# EAGLE schematic xen_teensy_motherboard_8cv_mki (EAGLE 9.6.0)
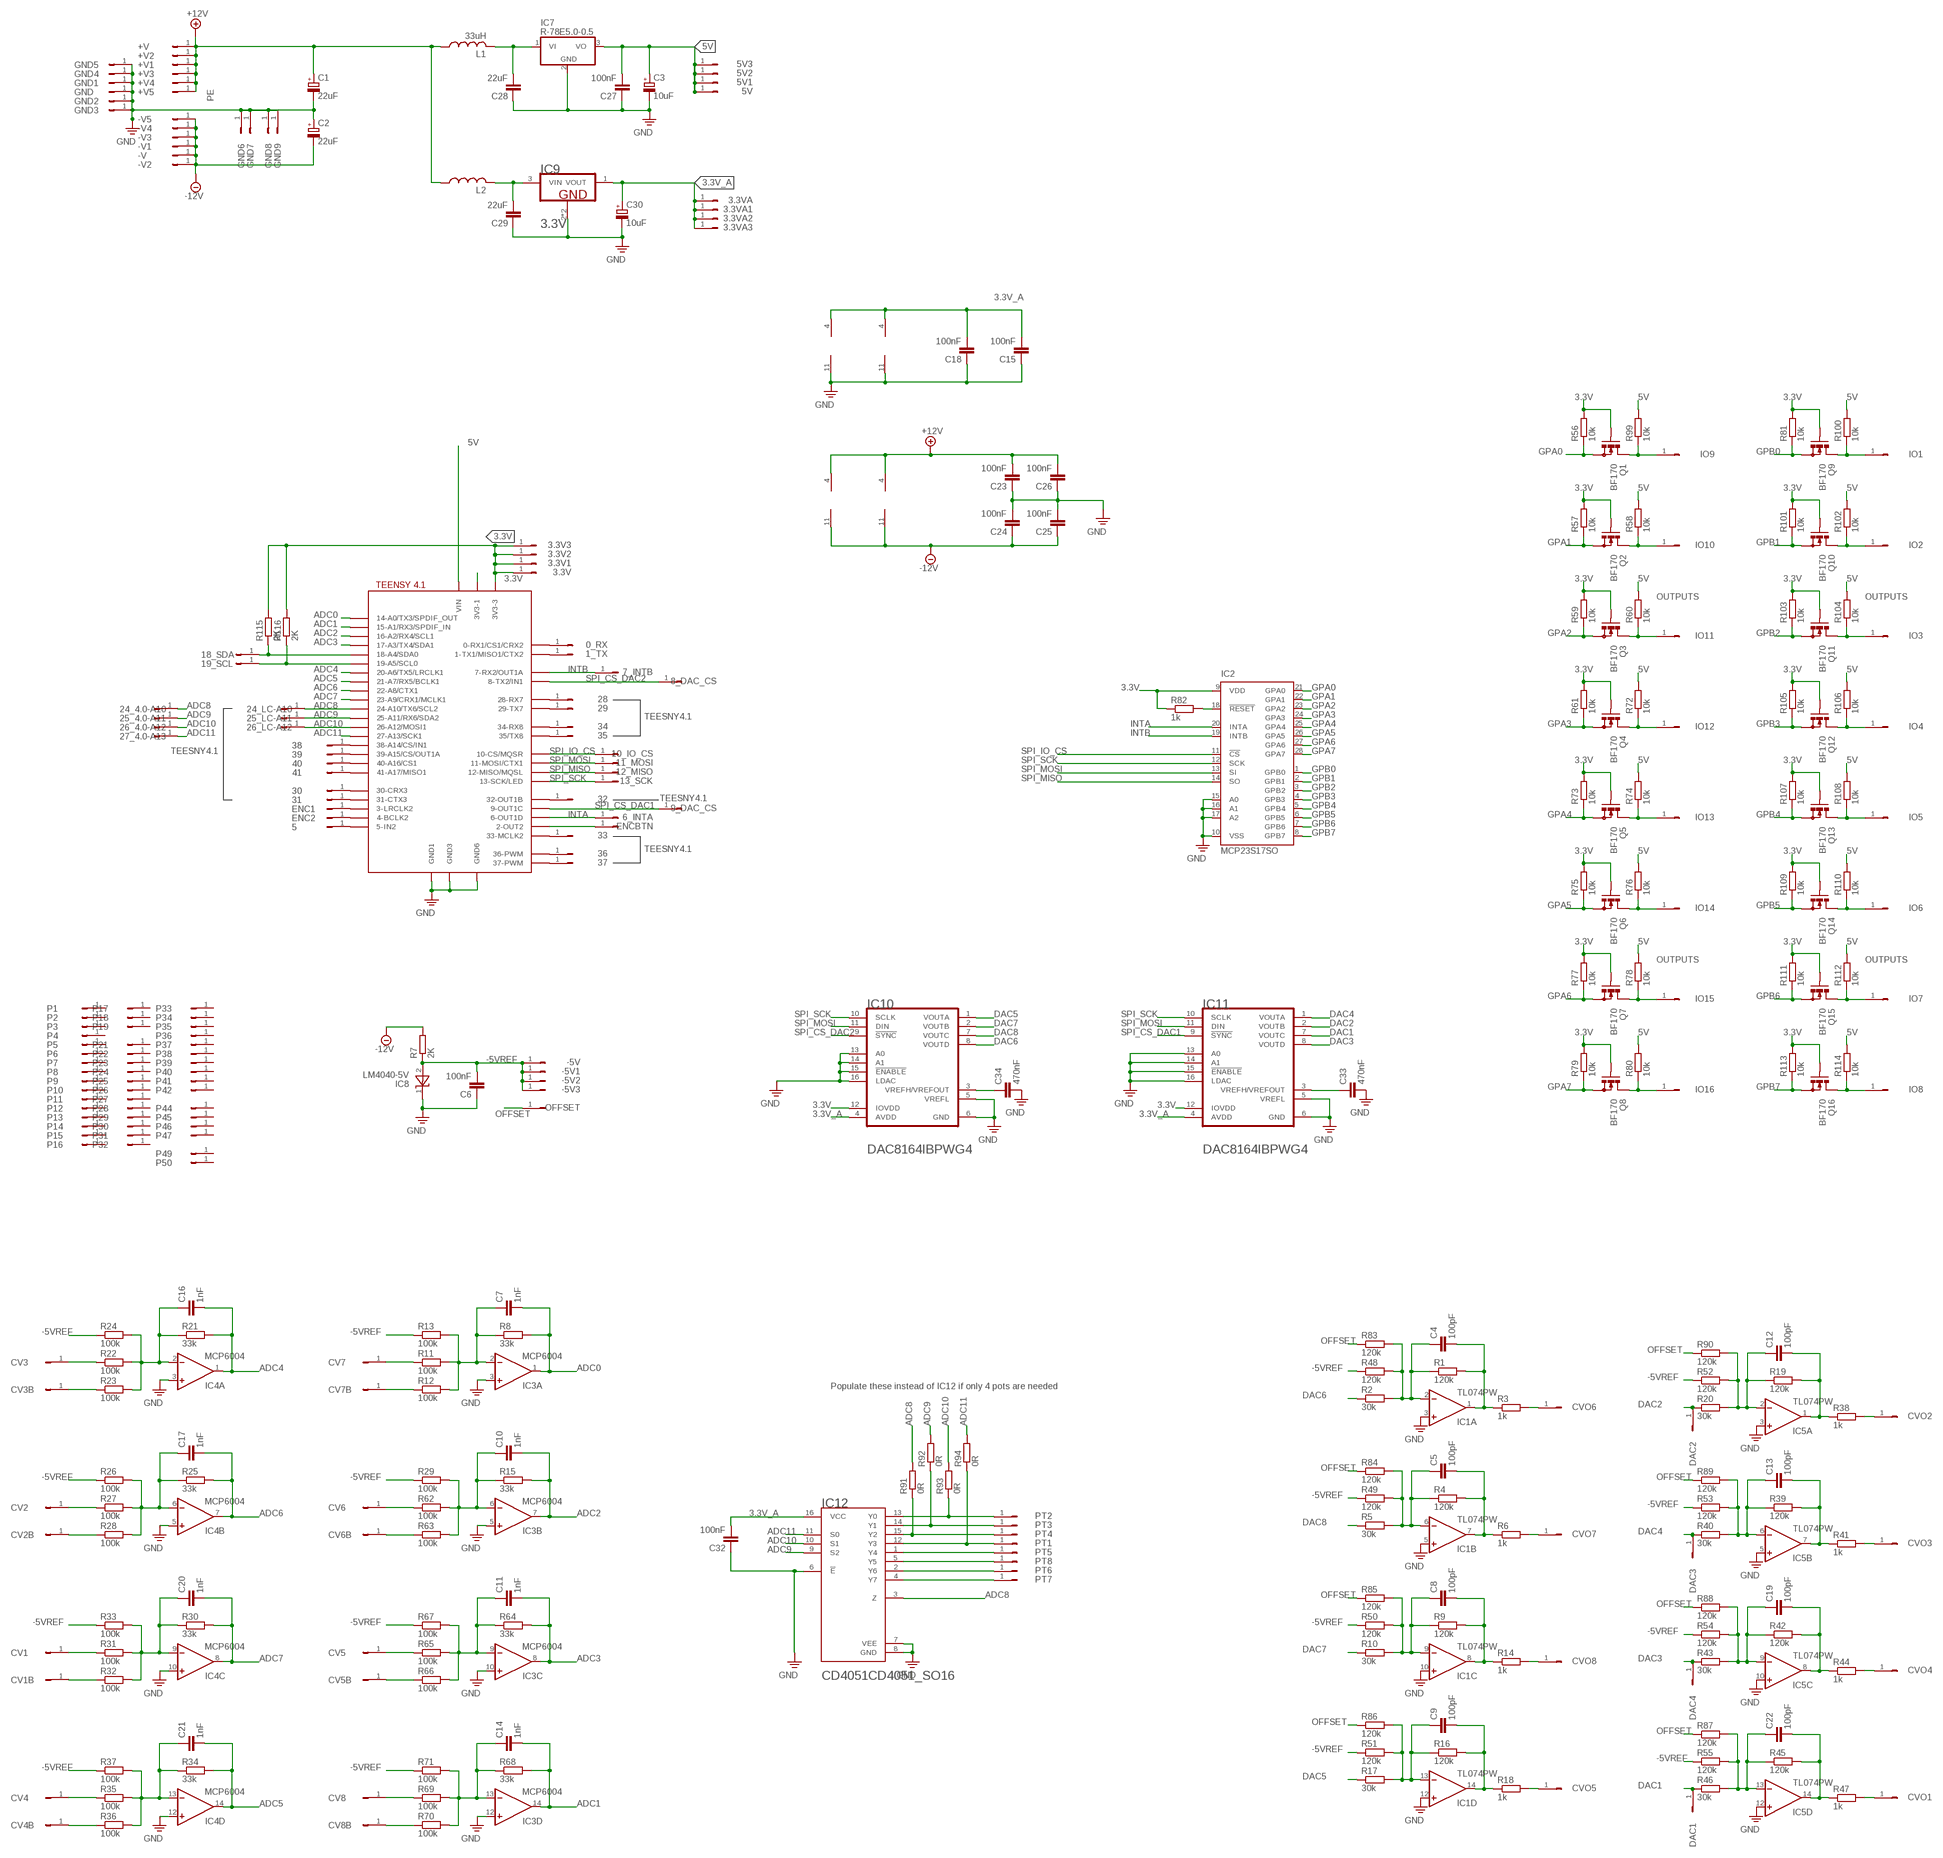
[diagram p0: schematic, sheet 1]

## Parts
0_RX  HEADER/MALE/01  [HEADER/MALE/01]
1_TX  HEADER/MALE/01  [HEADER/MALE/01]
3.3V  HEADER/MALE/01  [HEADER/MALE/01]
3.3V1  HEADER/MALE/01  [HEADER/MALE/01]
3.3V2  HEADER/MALE/01  [HEADER/MALE/01]
3.3V3  HEADER/MALE/01  [HEADER/MALE/01]
3.3VA  HEADER/MALE/01  [HEADER/MALE/01]
3.3VA1  HEADER/MALE/01  [HEADER/MALE/01]
3.3VA2  HEADER/MALE/01  [HEADER/MALE/01]
3.3VA3  HEADER/MALE/01  [HEADER/MALE/01]
5  HEADER/MALE/01  [HEADER/MALE/01]
5V  HEADER/MALE/01  [HEADER/MALE/01]
5V1  HEADER/MALE/01  [HEADER/MALE/01]
5V2  HEADER/MALE/01  [HEADER/MALE/01]
5V3  HEADER/MALE/01  [HEADER/MALE/01]
6_INTA  HEADER/MALE/01  [HEADER/MALE/01]
7_INTB  HEADER/MALE/01  [HEADER/MALE/01]
8_DAC_CS  HEADER/MALE/01  [HEADER/MALE/01]
9_DAC_CS  HEADER/MALE/01  [HEADER/MALE/01]
10_IO_CS  HEADER/MALE/01  [HEADER/MALE/01]
11_MOSI  HEADER/MALE/01  [HEADER/MALE/01]
12_MISO  HEADER/MALE/01  [HEADER/MALE/01]
13_SCK  HEADER/MALE/01  [HEADER/MALE/01]
18_SDA  HEADER/MALE/01  [HEADER/MALE/01]
19_SCL  HEADER/MALE/01  [HEADER/MALE/01]
24_4.0-A10  HEADER/MALE/01  [HEADER/MALE/01]
24_LC-A10  HEADER/MALE/01  [HEADER/MALE/01]
25_4.0-A11  HEADER/MALE/01  [HEADER/MALE/01]
25_LC-A11  HEADER/MALE/01  [HEADER/MALE/01]
26_4.0-A12  HEADER/MALE/01  [HEADER/MALE/01]
26_LC-A12  HEADER/MALE/01  [HEADER/MALE/01]
27_4.0-A13  HEADER/MALE/01  [HEADER/MALE/01]
28  HEADER/MALE/01  [HEADER/MALE/01]
29  HEADER/MALE/01  [HEADER/MALE/01]
30  HEADER/MALE/01  [HEADER/MALE/01]
31  HEADER/MALE/01  [HEADER/MALE/01]
32  HEADER/MALE/01  [HEADER/MALE/01]
33  HEADER/MALE/01  [HEADER/MALE/01]
34  HEADER/MALE/01  [HEADER/MALE/01]
35  HEADER/MALE/01  [HEADER/MALE/01]
36  HEADER/MALE/01  [HEADER/MALE/01]
37  HEADER/MALE/01  [HEADER/MALE/01]
38  HEADER/MALE/01  [HEADER/MALE/01]
39  HEADER/MALE/01  [HEADER/MALE/01]
40  HEADER/MALE/01  [HEADER/MALE/01]
41  HEADER/MALE/01  [HEADER/MALE/01]
+V  HEADER/MALE/01  [HEADER/MALE/01]
+V1  HEADER/MALE/01  [HEADER/MALE/01]
+V2  HEADER/MALE/01  [HEADER/MALE/01]
+V3  HEADER/MALE/01  [HEADER/MALE/01]
+V4  HEADER/MALE/01  [HEADER/MALE/01]
+V5  HEADER/MALE/01  [HEADER/MALE/01]
-5V  HEADER/MALE/01  [HEADER/MALE/01]
-5V1  HEADER/MALE/01  [HEADER/MALE/01]
-5V2  HEADER/MALE/01  [HEADER/MALE/01]
-5V3  HEADER/MALE/01  [HEADER/MALE/01]
-V  HEADER/MALE/01  [HEADER/MALE/01]
-V1  HEADER/MALE/01  [HEADER/MALE/01]
-V2  HEADER/MALE/01  [HEADER/MALE/01]
-V3  HEADER/MALE/01  [HEADER/MALE/01]
-V4  HEADER/MALE/01  [HEADER/MALE/01]
-V5  HEADER/MALE/01  [HEADER/MALE/01]
C1  22uF  CAPACITOR/POLARIZEDSMDC  [SV-C]
C2  22uF  CAPACITOR/POLARIZEDSMDC  [SV-C]
C3  10uF  CAPACITOR/POLARIZEDSMDB  [SV-B]
C4  100pF  CAPACITORC0603  [C0603]
C5  100pF  CAPACITORC0603  [C0603]
C6  100nF  CAPACITORC0603  [C0603]
C7  1nF  CAPACITORC0603  [C0603]
C8  100pF  CAPACITORC0603  [C0603]
C9  100pF  CAPACITORC0603  [C0603]
C10  1nF  CAPACITORC0603  [C0603]
C11  1nF  CAPACITORC0603  [C0603]
C12  100pF  CAPACITORC0603  [C0603]
C13  100pF  CAPACITORC0603  [C0603]
C14  1nF  CAPACITORC0603  [C0603]
C15  100nF  CAPACITORC0603  [C0603]
C16  1nF  CAPACITORC0603  [C0603]
C17  1nF  CAPACITORC0603  [C0603]
C18  100nF  CAPACITORC0603  [C0603]
C19  100pF  CAPACITORC0603  [C0603]
C20  1nF  CAPACITORC0603  [C0603]
C21  1nF  CAPACITORC0603  [C0603]
C22  100pF  CAPACITORC0603  [C0603]
C23  100nF  CAPACITORC0603  [C0603]
C24  100nF  CAPACITORC0603  [C0603]
C25  100nF  CAPACITORC0603  [C0603]
C26  100nF  CAPACITORC0603  [C0603]
C27  100nF  CAPACITORC0603  [C0603]
C28  22uF  CAPACITORC0805  [C0805]
C29  22uF  CAPACITORC0805  [C0805]
C30  10uF  CAPACITOR/POLARIZEDSMDB  [SV-B]
C32  100nF  CAPACITORC0603  [C0603]
C33  470nF  CAPACITORC0603  [C0603]
C34  470nF  CAPACITORC0603  [C0603]
CV1  HEADER/MALE/01  [HEADER/MALE/01]
CV1B  HEADER/MALE/01  [HEADER/MALE/01]
CV2  HEADER/MALE/01  [HEADER/MALE/01]
CV2B  HEADER/MALE/01  [HEADER/MALE/01]
CV3  HEADER/MALE/01  [HEADER/MALE/01]
CV3B  HEADER/MALE/01  [HEADER/MALE/01]
CV4  HEADER/MALE/01  [HEADER/MALE/01]
CV4B  HEADER/MALE/01  [HEADER/MALE/01]
CV5  HEADER/MALE/01  [HEADER/MALE/01]
CV5B  HEADER/MALE/01  [HEADER/MALE/01]
CV6  HEADER/MALE/01  [HEADER/MALE/01]
CV6B  HEADER/MALE/01  [HEADER/MALE/01]
CV7  HEADER/MALE/01  [HEADER/MALE/01]
CV7B  HEADER/MALE/01  [HEADER/MALE/01]
CV8  HEADER/MALE/01  [HEADER/MALE/01]
CV8B  HEADER/MALE/01  [HEADER/MALE/01]
CVO1  HEADER/MALE/01  [HEADER/MALE/01]
CVO2  HEADER/MALE/01  [HEADER/MALE/01]
CVO3  HEADER/MALE/01  [HEADER/MALE/01]
CVO4  HEADER/MALE/01  [HEADER/MALE/01]
CVO5  HEADER/MALE/01  [HEADER/MALE/01]
CVO6  HEADER/MALE/01  [HEADER/MALE/01]
CVO7  HEADER/MALE/01  [HEADER/MALE/01]
CVO8  HEADER/MALE/01  [HEADER/MALE/01]
DAC1  HEADER/MALE/01  [HEADER/MALE/01]
DAC2  HEADER/MALE/01  [HEADER/MALE/01]
DAC3  HEADER/MALE/01  [HEADER/MALE/01]
DAC4  HEADER/MALE/01  [HEADER/MALE/01]
ENC1  HEADER/MALE/01  [HEADER/MALE/01]
ENC2  HEADER/MALE/01  [HEADER/MALE/01]
ENCBTN  HEADER/MALE/01  [HEADER/MALE/01]
GND  HEADER/MALE/01  [HEADER/MALE/01]
GND1  HEADER/MALE/01  [HEADER/MALE/01]
GND2  HEADER/MALE/01  [HEADER/MALE/01]
GND3  HEADER/MALE/01  [HEADER/MALE/01]
GND4  HEADER/MALE/01  [HEADER/MALE/01]
GND5  HEADER/MALE/01  [HEADER/MALE/01]
GND6  HEADER/MALE/01  [HEADER/MALE/01]
GND7  HEADER/MALE/01  [HEADER/MALE/01]
GND8  HEADER/MALE/01  [HEADER/MALE/01]
GND9  HEADER/MALE/01  [HEADER/MALE/01]
IC1  TL074PW  [TSSOP14]
IC2  MCP23S17SO  [SO28W]
IC3  MCP6004  TL074PW  [TSSOP14]
IC4  MCP6004  TL074PW  [TSSOP14]
IC5  TL074PW  [TSSOP14]
IC6  TEENSY41-OUTER  [TENNSY41-OUTER]
IC7  R-78E5.0-0.5  WE173950378  [WE78]
IC8  LM4040-5V  LM4040CYM3-2.5  [SOT-23]
IC9  3.3V  LD2981LD2981-SOT89  [LD2981-SOT89]
IC10  TEXAS_INSTRUMENTS_DAC8164IBPWG4TEXAS_INSTRUMENTS_DAC8164IBPWG4_0_1  [TEXAS_INSTRUMENTS_DAC8164IBPWG4_1]
IC11  TEXAS_INSTRUMENTS_DAC8164IBPWG4TEXAS_INSTRUMENTS_DAC8164IBPWG4_0_1  [TEXAS_INSTRUMENTS_DAC8164IBPWG4_1]
IC12  CD4051CD4051_SO16  [SO16]
IO1  HEADER/MALE/01  [HEADER/MALE/01]
IO2  HEADER/MALE/01  [HEADER/MALE/01]
IO3  HEADER/MALE/01  [HEADER/MALE/01]
IO4  HEADER/MALE/01  [HEADER/MALE/01]
IO5  HEADER/MALE/01  [HEADER/MALE/01]
IO6  HEADER/MALE/01  [HEADER/MALE/01]
IO7  HEADER/MALE/01  [HEADER/MALE/01]
IO8  HEADER/MALE/01  [HEADER/MALE/01]
IO9  HEADER/MALE/01  [HEADER/MALE/01]
IO10  HEADER/MALE/01  [HEADER/MALE/01]
IO11  HEADER/MALE/01  [HEADER/MALE/01]
IO12  HEADER/MALE/01  [HEADER/MALE/01]
IO13  HEADER/MALE/01  [HEADER/MALE/01]
IO14  HEADER/MALE/01  [HEADER/MALE/01]
IO15  HEADER/MALE/01  [HEADER/MALE/01]
IO16  HEADER/MALE/01  [HEADER/MALE/01]
L1  33uH  INDUCTORL2012C  [L2012C]
L2  INDUCTORL0603  [R0603]
OFFSET  HEADER/MALE/01  [HEADER/MALE/01]
P1  HEADER/MALE/01NOBORDER  [HEADER/MALE/01/NOBORDER]
P2  HEADER/MALE/01NOBORDER  [HEADER/MALE/01/NOBORDER]
P3  HEADER/MALE/01NOBORDER  [HEADER/MALE/01/NOBORDER]
P4  HEADER/MALE/01NOBORDER  [HEADER/MALE/01/NOBORDER]
P5  HEADER/MALE/01NOBORDER  [HEADER/MALE/01/NOBORDER]
P6  HEADER/MALE/01NOBORDER  [HEADER/MALE/01/NOBORDER]
P7  HEADER/MALE/01NOBORDER  [HEADER/MALE/01/NOBORDER]
P8  HEADER/MALE/01NOBORDER  [HEADER/MALE/01/NOBORDER]
P9  HEADER/MALE/01NOBORDER  [HEADER/MALE/01/NOBORDER]
P10  HEADER/MALE/01NOBORDER  [HEADER/MALE/01/NOBORDER]
P11  HEADER/MALE/01NOBORDER  [HEADER/MALE/01/NOBORDER]
P12  HEADER/MALE/01NOBORDER  [HEADER/MALE/01/NOBORDER]
P13  HEADER/MALE/01NOBORDER  [HEADER/MALE/01/NOBORDER]
P14  HEADER/MALE/01NOBORDER  [HEADER/MALE/01/NOBORDER]
P15  HEADER/MALE/01NOBORDER  [HEADER/MALE/01/NOBORDER]
P16  HEADER/MALE/01NOBORDER  [HEADER/MALE/01/NOBORDER]
P17  HEADER/MALE/01NOBORDER  [HEADER/MALE/01/NOBORDER]
P18  HEADER/MALE/01NOBORDER  [HEADER/MALE/01/NOBORDER]
P19  HEADER/MALE/01NOBORDER  [HEADER/MALE/01/NOBORDER]
P21  HEADER/MALE/01NOBORDER  [HEADER/MALE/01/NOBORDER]
P22  HEADER/MALE/01NOBORDER  [HEADER/MALE/01/NOBORDER]
P23  HEADER/MALE/01NOBORDER  [HEADER/MALE/01/NOBORDER]
P24  HEADER/MALE/01NOBORDER  [HEADER/MALE/01/NOBORDER]
P25  HEADER/MALE/01NOBORDER  [HEADER/MALE/01/NOBORDER]
P26  HEADER/MALE/01NOBORDER  [HEADER/MALE/01/NOBORDER]
P27  HEADER/MALE/01NOBORDER  [HEADER/MALE/01/NOBORDER]
P28  HEADER/MALE/01NOBORDER  [HEADER/MALE/01/NOBORDER]
P29  HEADER/MALE/01NOBORDER  [HEADER/MALE/01/NOBORDER]
P30  HEADER/MALE/01NOBORDER  [HEADER/MALE/01/NOBORDER]
P31  HEADER/MALE/01NOBORDER  [HEADER/MALE/01/NOBORDER]
P32  HEADER/MALE/01NOBORDER  [HEADER/MALE/01/NOBORDER]
P33  HEADER/MALE/01NOBORDER  [HEADER/MALE/01/NOBORDER]
P34  HEADER/MALE/01NOBORDER  [HEADER/MALE/01/NOBORDER]
P35  HEADER/MALE/01NOBORDER  [HEADER/MALE/01/NOBORDER]
P36  HEADER/MALE/01NOBORDER  [HEADER/MALE/01/NOBORDER]
P37  HEADER/MALE/01NOBORDER  [HEADER/MALE/01/NOBORDER]
P38  HEADER/MALE/01NOBORDER  [HEADER/MALE/01/NOBORDER]
P39  HEADER/MALE/01NOBORDER  [HEADER/MALE/01/NOBORDER]
P40  HEADER/MALE/01NOBORDER  [HEADER/MALE/01/NOBORDER]
P41  HEADER/MALE/01NOBORDER  [HEADER/MALE/01/NOBORDER]
P42  HEADER/MALE/01NOBORDER  [HEADER/MALE/01/NOBORDER]
P44  HEADER/MALE/01NOBORDER  [HEADER/MALE/01/NOBORDER]
P45  HEADER/MALE/01NOBORDER  [HEADER/MALE/01/NOBORDER]
P46  HEADER/MALE/01NOBORDER  [HEADER/MALE/01/NOBORDER]
P47  HEADER/MALE/01NOBORDER  [HEADER/MALE/01/NOBORDER]
P49  HEADER/MALE/01NOBORDER  [HEADER/MALE/01/NOBORDER]
P50  HEADER/MALE/01NOBORDER  [HEADER/MALE/01/NOBORDER]
PT1  HEADER/MALE/01  [HEADER/MALE/01]
PT2  HEADER/MALE/01  [HEADER/MALE/01]
PT3  HEADER/MALE/01  [HEADER/MALE/01]
PT4  HEADER/MALE/01  [HEADER/MALE/01]
PT5  HEADER/MALE/01  [HEADER/MALE/01]
PT6  HEADER/MALE/01  [HEADER/MALE/01]
PT7  HEADER/MALE/01  [HEADER/MALE/01]
PT8  HEADER/MALE/01  [HEADER/MALE/01]
Q1  BF170  BS170SOT23  [SOT23]
Q2  BF170  BS170SOT23  [SOT23]
Q3  BF170  BS170SOT23  [SOT23]
Q4  BF170  BS170SOT23  [SOT23]
Q5  BF170  BS170SOT23  [SOT23]
Q6  BF170  BS170SOT23  [SOT23]
Q7  BF170  BS170SOT23  [SOT23]
Q8  BF170  BS170SOT23  [SOT23]
Q9  BF170  BS170SOT23  [SOT23]
Q10  BF170  BS170SOT23  [SOT23]
Q11  BF170  BS170SOT23  [SOT23]
Q12  BF170  BS170SOT23  [SOT23]
Q13  BF170  BS170SOT23  [SOT23]
Q14  BF170  BS170SOT23  [SOT23]
Q15  BF170  BS170SOT23  [SOT23]
Q16  BF170  BS170SOT23  [SOT23]
R1  120k  RESISTOR  [R0603]
R2  30k  RESISTOR  [R0603]
R3  1k  RESISTOR  [R0603]
R4  120k  RESISTOR  [R0603]
R5  30k  RESISTOR  [R0603]
R6  1k  RESISTOR  [R0603]
R7  2K  RESISTOR  [R0603]
R8  33k  RESISTOR  [R0603]
R9  120k  RESISTOR  [R0603]
R10  30k  RESISTOR  [R0603]
R11  100k  RESISTOR  [R0603]
R12  100k  RESISTOR  [R0603]
R13  100k  RESISTOR  [R0603]
R14  1k  RESISTOR  [R0603]
R15  33k  RESISTOR  [R0603]
R16  120k  RESISTOR  [R0603]
R17  30k  RESISTOR  [R0603]
R18  1k  RESISTOR  [R0603]
R19  120k  RESISTOR  [R0603]
R20  30k  RESISTOR  [R0603]
R21  33k  RESISTOR  [R0603]
R22  100k  RESISTOR  [R0603]
R23  100k  RESISTOR  [R0603]
R24  100k  RESISTOR  [R0603]
R25  33k  RESISTOR  [R0603]
R26  100k  RESISTOR  [R0603]
R27  100k  RESISTOR  [R0603]
R28  100k  RESISTOR  [R0603]
R29  100k  RESISTOR  [R0603]
R30  33k  RESISTOR  [R0603]
R31  100k  RESISTOR  [R0603]
R32  100k  RESISTOR  [R0603]
R33  100k  RESISTOR  [R0603]
R34  33k  RESISTOR  [R0603]
R35  100k  RESISTOR  [R0603]
R36  100k  RESISTOR  [R0603]
R37  100k  RESISTOR  [R0603]
R38  1k  RESISTOR  [R0603]
R39  120k  RESISTOR  [R0603]
R40  30k  RESISTOR  [R0603]
R41  1k  RESISTOR  [R0603]
R42  120k  RESISTOR  [R0603]
R43  30k  RESISTOR  [R0603]
R44  1k  RESISTOR  [R0603]
R45  120k  RESISTOR  [R0603]
R46  30k  RESISTOR  [R0603]
R47  1k  RESISTOR  [R0603]
R48  120k  RESISTOR  [R0603]
R49  120k  RESISTOR  [R0603]
R50  120k  RESISTOR  [R0603]
R51  120k  RESISTOR  [R0603]
R52  120k  RESISTOR  [R0603]
R53  120k  RESISTOR  [R0603]
R54  120k  RESISTOR  [R0603]
R55  120k  RESISTOR  [R0603]
R56  10k  RESISTOR  [R0603]
R57  10k  RESISTOR  [R0603]
R58  10k  RESISTOR  [R0603]
R59  10k  RESISTOR  [R0603]
R60  10k  RESISTOR  [R0603]
R61  10k  RESISTOR  [R0603]
R62  100k  RESISTOR  [R0603]
R63  100k  RESISTOR  [R0603]
R64  33k  RESISTOR  [R0603]
R65  100k  RESISTOR  [R0603]
R66  100k  RESISTOR  [R0603]
R67  100k  RESISTOR  [R0603]
R68  33k  RESISTOR  [R0603]
R69  100k  RESISTOR  [R0603]
R70  100k  RESISTOR  [R0603]
R71  100k  RESISTOR  [R0603]
R72  10k  RESISTOR  [R0603]
R73  10k  RESISTOR  [R0603]
R74  10k  RESISTOR  [R0603]
R75  10k  RESISTOR  [R0603]
R76  10k  RESISTOR  [R0603]
R77  10k  RESISTOR  [R0603]
R78  10k  RESISTOR  [R0603]
R79  10k  RESISTOR  [R0603]
R80  10k  RESISTOR  [R0603]
R81  10k  RESISTOR  [R0603]
R82  1k  RESISTOR  [R0603]
R83  120k  RESISTOR  [R0603]
R84  120k  RESISTOR  [R0603]
R85  120k  RESISTOR  [R0603]
R86  120k  RESISTOR  [R0603]
R87  120k  RESISTOR  [R0603]
R88  120k  RESISTOR  [R0603]
R89  120k  RESISTOR  [R0603]
R90  120k  RESISTOR  [R0603]
R91  0R  RESISTOR  [R0603]
R92  0R  RESISTOR  [R0603]
R93  0R  RESISTOR  [R0603]
R94  0R  RESISTOR  [R0603]
R99  10k  RESISTOR  [R0603]
R100  10k  RESISTOR  [R0603]
R101  10k  RESISTOR  [R0603]
R102  10k  RESISTOR  [R0603]
R103  10k  RESISTOR  [R0603]
R104  10k  RESISTOR  [R0603]
R105  10k  RESISTOR  [R0603]
R106  10k  RESISTOR  [R0603]
R107  10k  RESISTOR  [R0603]
R108  10k  RESISTOR  [R0603]
R109  10k  RESISTOR  [R0603]
R110  10k  RESISTOR  [R0603]
R111  10k  RESISTOR  [R0603]
R112  10k  RESISTOR  [R0603]
R113  10k  RESISTOR  [R0603]
R114  10k  RESISTOR  [R0603]
R115  2K  RESISTOR  [R0603]
R116  2K  RESISTOR  [R0603]

## Nets
3.3V: 3.3V1.1 3.3V2.1 3.3V3.1 3.3V.1 IC2.9(VDD) IC6.3V3-3 IC10.12(IOVDD) IC11.12(IOVDD) Q1.1(G) Q2.1(G) Q3.1(G) Q4.1(G) Q5.1(G) Q6.1(G) Q7.1(G) Q8.1(G) Q9.1(G) Q10.1(G) Q11.1(G) Q12.1(G) Q13.1(G) Q14.1(G) Q15.1(G) Q16.1(G) R56.2 R57.2 R59.2 R61.2 R73.2 R75.2 R77.2 R79.2 R81.2 R82.1 R101.2 R103.2 R105.2 R107.2 R109.2 R111.2 R113.2 R115.2 R116.2
3.3V_A: 3.3VA1.1 3.3VA2.1 3.3VA3.1 3.3VA.1 C15.2 C18.2 C30.+ C32.2 IC3.4(P:V+) IC4.4(P:V+) IC9.1(VOUT) IC10.4(AVDD) IC11.4(AVDD) IC12.16(VCC)
5V: 5V1.1 5V2.1 5V3.1 5V.1 C3.+ C27.2 IC6.VIN IC7.3(VO) R58.2 R60.2 R72.2 R74.2 R76.2 R78.2 R80.2 R99.2 R100.2 R102.2 R104.2 R106.2 R108.2 R110.2 R112.2 R114.2
+12V: +V1.1 +V2.1 +V3.1 +V4.1 +V5.1 +V.1 C1.+ C23.2 C26.2 IC1.4(P:V+) IC5.4(P:V+) L1.1 L2.1
-5VREF: -5V1.1 -5V2.1 -5V3.1 -5V.1 C6.2 IC8.2(A) R7.1 R13.1 R24.1 R26.1 R29.1 R33.1 R37.1 R48.1 R49.1 R50.1 R51.1 R52.1 R53.1 R54.1 R55.1 R67.1 R71.1
-12V: -V1.1 -V2.1 -V3.1 -V4.1 -V5.1 -V.1 C2.- C24.1 C25.1 IC1.11(P:V-) IC5.11(P:V-) R7.2
ADC0: C7.2 IC3.1(A:OUT) IC6.14-A0/TX3/SPDIF_OUT R8.2
ADC1: C14.2 IC3.14(D:OUT) IC6.15-A1/RX3/SPDIF_IN R68.2
ADC2: C10.2 IC3.7(B:OUT) IC6.16-A2/RX4/SCL1 R15.2
ADC3: C11.2 IC3.8(C:OUT) IC6.17-A3/TX4/SDA1 R64.2
ADC4: C16.2 IC4.1(A:OUT) IC6.20-A6/TX5/LRCLK1 R21.2
ADC5: C21.2 IC4.14(D:OUT) IC6.21-A7/RX5/BCLK1 R34.2
ADC6: C17.2 IC4.7(B:OUT) IC6.22-A8/CTX1 R25.2
ADC7: C20.2 IC4.8(C:OUT) IC6.23-A9/CRX1/MCLK1 R30.2
ADC8: 24_4.0-A10.1 24_LC-A10.1 IC6.24-A10/TX6/SCL2 IC12.3(Z) R91.2
ADC9: 25_4.0-A11.1 25_LC-A11.1 IC6.25-A11/RX6/SDA2 IC12.9(S2) R92.2
ADC10: 26_4.0-A12.1 26_LC-A12.1 IC6.26-A12/MOSI1 IC12.10(S1) R93.2
ADC11: 27_4.0-A13.1 IC6.27-A13/SCK1 IC12.11(S0) R94.2
DAC1: DAC1.1 IC11.7(VOUTC) R46.1
DAC2: DAC2.1 IC11.2(VOUTB) R20.1
DAC3: DAC4.1 IC11.8(VOUTD) R43.1
DAC4: DAC3.1 IC11.1(VOUTA) R40.1
DAC5: IC10.1(VOUTA) R17.1
DAC6: IC10.8(VOUTD) R2.1
DAC7: IC10.2(VOUTB) R10.1
DAC8: IC10.7(VOUTC) R5.1
GPA0: IC2.21(GPA0) Q1.2(S) R56.1
GPA1: IC2.22(GPA1) Q2.2(S) R57.1
GPA2: IC2.23(GPA2) Q3.2(S) R59.1
GPA3: IC2.24(GPA3) Q4.2(S) R61.1
GPA4: IC2.25(GPA4) Q5.2(S) R73.1
GPA5: IC2.26(GPA5) Q6.2(S) R75.1
GPA6: IC2.27(GPA6) Q7.2(S) R77.1
GPA7: IC2.28(GPA7) Q8.2(S) R79.1
GPB0: IC2.1(GPB0) Q9.2(S) R81.1
GPB1: IC2.2(GPB1) Q10.2(S) R101.1
GPB2: IC2.3(GPB2) Q11.2(S) R103.1
GPB3: IC2.4(GPB3) Q12.2(S) R105.1
GPB4: IC2.5(GPB4) Q13.2(S) R107.1
GPB5: IC2.6(GPB5) Q14.2(S) R109.1
GPB6: IC2.7(GPB6) Q15.2(S) R111.1
GPB7: IC2.8(GPB7) Q16.2(S) R113.1
INTA: 6_INTA.1 IC2.20(INTA) IC6.6-OUT1D
INTB: 7_INTB.1 IC2.19(INTB) IC6.7-RX2/OUT1A
N$1: CV2.1 R27.1
N$2: C4.1 IC1.2(A:-IN) R1.1 R2.2 R48.2 R83.2
N$3: C4.2 IC1.1(A:OUT) R1.2 R3.1
N$4: CVO6.1 R3.2
N$5: C5.1 IC1.6(B:-IN) R4.1 R5.2 R49.2 R84.2
N$6: C5.2 IC1.7(B:OUT) R4.2 R6.1
N$7: CVO7.1 R6.2
N$8: C7.1 IC3.2(A:-IN) R8.1 R11.2 R12.2 R13.2
N$9: C8.1 IC1.9(C:-IN) R9.1 R10.2 R50.2 R85.2
N$10: C8.2 IC1.8(C:OUT) R9.2 R14.1
N$11: CVO8.1 R14.2
N$12: C9.1 IC1.13(D:-IN) R16.1 R17.2 R51.2 R86.2
N$13: CV7B.1 R12.1
N$14: CV7.1 R11.1
N$15: C9.2 IC1.14(D:OUT) R16.2 R18.1
N$16: C10.1 IC3.6(B:-IN) R15.1 R29.2 R62.2 R63.2
N$17: CVO5.1 R18.2
N$18: CV6.1 R62.1
N$19: CV6B.1 R63.1
N$20: C12.1 IC5.2(A:-IN) R19.1 R20.2 R52.2 R90.2
N$21: C12.2 IC5.1(A:OUT) R19.2 R38.1
N$22: CV3.1 R22.1
N$23: 0_RX.1 IC6.0-RX1/CS1/CRX2
N$24: C16.1 IC4.2(A:-IN) R21.1 R22.2 R23.2 R24.2
N$25: CVO2.1 R38.2
N$26: CV2B.1 R28.1
N$27: CV3B.1 R23.1
N$28: C13.1 IC5.6(B:-IN) R39.1 R40.2 R53.2 R89.2
N$29: C17.1 IC4.6(B:-IN) R25.1 R26.2 R27.2 R28.2
N$30: C21.1 IC4.13(D:-IN) R34.1 R35.2 R36.2 R37.2
N$31: CV4.1 R35.1
N$32: CV4B.1 R36.1
N$33: C13.2 IC5.7(B:OUT) R39.2 R41.1
N$34: CV1B.1 R32.1
N$35: CV1.1 R31.1
N$36: C20.1 IC4.9(C:-IN) R30.1 R31.2 R32.2 R33.2
N$37: 1_TX.1 IC6.1-TX1/MISO1/CTX2
N$38: ENC2.1 IC6.4-BCLK2
N$39: ENC1.1 IC6.3-LRCLK2
N$40: ENCBTN.1 IC6.2-OUT2
N$41: IC12.1(Y4) PT5.1
N$42: CVO3.1 R41.2
N$43: C19.1 IC5.9(C:-IN) R42.1 R43.2 R54.2 R88.2
N$44: C19.2 IC5.8(C:OUT) R42.2 R44.1
N$45: 18_SDA.1 IC6.18-A4/SDA0 R115.1
N$46: 19_SCL.1 IC6.19-A5/SCL0 R116.1
N$47: CVO4.1 R44.2
N$48: C22.1 IC5.13(D:-IN) R45.1 R46.2 R55.2 R87.2
N$49: C22.2 IC5.14(D:OUT) R45.2 R47.1
N$50: CVO1.1 R47.2
N$51: C28.2 IC7.1(VI) L1.2
N$52: IC12.5(Y5) PT8.1
N$53: IO9.1 Q1.3(D) R99.1
N$54: IC12.12(Y3) PT1.1 R94.1
N$55: IO10.1 Q2.3(D) R58.1
N$56: IC12.15(Y2) PT4.1 R91.1
N$57: C14.1 IC3.13(D:-IN) R68.1 R69.2 R70.2 R71.2
N$58: IO11.1 Q3.3(D) R60.1
N$59: IC12.13(Y0) PT2.1 R93.1
N$60: CV8.1 R69.1
N$61: IO12.1 Q4.3(D) R72.1
N$62: IC12.14(Y1) PT3.1 R92.1
N$63: IO13.1 Q5.3(D) R74.1
N$64: IC12.2(Y6) PT6.1
N$65: IO14.1 Q6.3(D) R76.1
N$66: IC12.4(Y7) PT7.1
N$67: IO15.1 Q7.3(D) R78.1
N$68: CV8B.1 R70.1
N$69: CV5B.1 R66.1
N$70: CV5.1 R65.1
N$71: C11.1 IC3.9(C:-IN) R64.1 R65.2 R66.2 R67.2
N$72: C29.2 IC9.3(VIN) L2.2
N$73: IO16.1 Q8.3(D) R80.1
N$74: IC6.3V3-1
N$86: IO1.1 Q9.3(D) R100.1
N$88: IO2.1 Q10.3(D) R102.1
N$90: IO3.1 Q11.3(D) R104.1
N$92: IO4.1 Q12.3(D) R106.1
N$94: IO5.1 Q13.3(D) R108.1
N$96: IO6.1 Q14.3(D) R110.1
N$98: IO7.1 Q15.3(D) R112.1
N$100: IO8.1 Q16.3(D) R114.1
N$101: IC2.18(!RESET) R82.2
N$104: 5.1 IC6.5-IN2
N$107: C34.1 IC10.3(VREFH/VREFOUT)
N$108: 28.1 IC6.28-RX7
N$109: 29.1 IC6.29-TX7
N$110: 30.1 IC6.30-CRX3
N$111: 31.1 IC6.31-CTX3
N$112: 32.1 IC6.32-OUT1B
N$113: 41.1 IC6.41-A17/MISO1
N$114: 40.1 IC6.40-A16/CS1
N$115: 39.1 IC6.39-A15/CS/OUT1A
N$116: 38.1 IC6.38-A14/CS/IN1
N$117: C33.1 IC11.3(VREFH/VREFOUT)
N$118: 34.1 IC6.34-RX8
N$119: 35.1 IC6.35-TX8(35/TX8)
N$120: 33.1 IC6.33-MCLK2
N$121: 36.1 IC6.36-PWM
N$122: 37.1 IC6.37-PWM
OFFSET: OFFSET.1 R83.1 R84.1 R85.1 R86.1 R87.1 R88.1 R89.1 R90.1
PE: C1.- C2.+ C3.- C6.1 C15.1 C18.1 C23.1 C24.2 C25.2 C26.1 C27.1 C28.1 C29.1 C30.- C32.1 C33.2 C34.2 GND1.1 GND2.1 GND3.1 GND4.1 GND5.1 GND6.1 GND7.1 GND8.1 GND9.1 GND.1 IC1.3(A:+IN) IC1.5(B:+IN) IC1.10(C:+IN) IC1.12(D:+IN) IC2.10(VSS) IC2.15(A0) IC2.16(A1) IC2.17(A2) IC3.3(A:+IN) IC3.5(B:+IN) IC3.10(C:+IN) IC3.11(P:V-) IC3.12(D:+IN) IC4.3(A:+IN) IC4.5(B:+IN) IC4.10(C:+IN) IC4.11(P:V-) IC4.12(D:+IN) IC5.3(A:+IN) IC5.5(B:+IN) IC5.10(C:+IN) IC5.12(D:+IN) IC6.GND1 IC6.GND3 IC6.GND6 IC7.2(GND) IC8.1(C) IC9.2(GND) IC9.2-2(GND) IC10.5(VREFL) IC10.6(GND) IC10.13(A0) IC10.14(A1) IC10.15(!ENABLE!) IC10.16(LDAC) IC11.5(VREFL) IC11.6(GND) IC11.13(A0) IC11.14(A1) IC11.15(!ENABLE!) IC11.16(LDAC) IC12.6(!E!) IC12.7(VEE) IC12.8(GND) ; supply symbol labelled GND
SPI_CS_DAC1: 9_DAC_CS.1 IC6.9-OUT1C IC11.9(!SYNC!)
SPI_CS_DAC2: 8_DAC_CS.1 IC6.8-TX2/IN1 IC10.9(!SYNC!)
SPI_IO_CS: 10_IO_CS.1 IC2.11(!CS) IC6.10-CS\MQSR(10-CS/MQSR)
SPI_MISO: 12_MISO.1 IC2.14(SO) IC6.12-MISO/MQSL
SPI_MOSI: 11_MOSI.1 IC2.13(SI) IC6.11-MOSI/CTX1 IC10.11(DIN) IC11.11(DIN)
SPI_SCK: 13_SCK.1 IC2.12(SCK) IC6.13-SCK/LED IC10.10(SCLK) IC11.10(SCLK)
Unconnected: P1.1 P2.1 P3.1 P4.1 P5.1 P6.1 P7.1 P8.1 P9.1 P10.1 P11.1 P12.1 P13.1 P14.1 P15.1 P16.1 P17.1 P18.1 P19.1 P21.1 P22.1 P23.1 P24.1 P25.1 P26.1 P27.1 P28.1 P29.1 P30.1 P31.1 P32.1 P33.1 P34.1 P35.1 P36.1 P37.1 P38.1 P39.1 P40.1 P41.1 P42.1 P44.1 P45.1 P46.1 P47.1 P49.1 P50.1

## Notes on the sheet
- OUTPUTS | OUTPUTS
- TEESNY4.1
- TEESNY4.1
- TEESNY4.1
- TEESNY4.1
- OUTPUTS | OUTPUTS
- Populate these instead of IC12 if only 4 pots are needed

## Library data of the parts
0_RX 1_TX 3.3V 3.3V1-3.3V3 3.3VA 3.3VA1-3.3VA3 5 5V 5V1-5V3 6_INTA 7_INTB 8_DAC_CS 9_DAC_CS 10_IO_CS 11_MOSI 12_MISO 13_SCK 18_SDA 19_SCL 24_4.0-A10 24_LC-A10 25_4.0-A11 25_LC-A11 26_4.0-A12 26_LC-A12 27_4.0-A13 28-41 +V +V1-+V5 -5V -5V1--5V3 -V -V1--V5 CV1 CV1B CV2 CV2B CV3 CV3B CV4 CV4B CV5 CV5B CV6 CV6B CV7 CV7B CV8 CV8B CVO1-CVO8 DAC1-DAC4 ENC1 ENC2 ENCBTN GND GND1-GND9 IO1-IO16 OFFSET P1-P19 P21-P42 P44-P47 P49 P50 PT1-PT8 = connectors:HEADER/MALE/01; SPICEPREFIX: X
C1-C3 C30 = capacitors:CAPACITOR/POLARIZED: POLARIZED CAPACITOR, European symbol; SPICEPREFIX: C
C4-C29 C32-C34 = capacitors:CAPACITOR: CAPACITOR, European symbol
IC1 IC3-IC5 = ic_analogue:TL074: OP AMP
IC2 = ic_digital:MCP23S17: http://ww1.microchip.com/downloads/en/DeviceDoc/21952a.pdf Source: http://ww1.microchip.com/downloads/en/DeviceDoc/21952a.pdf; MF: MICROCHIP; MPN: MCP23S17-E/SO; OC_FARNELL: unknown; OC_NEWARK: 31K2950
IC6 = microcontroller:TEENSY41-OUTER
IC7 = ic_voltage_reg:WE173950378
IC8 = ic_voltage_reg:LM4040
IC9 = ic_voltage_reg:LD2981: PM-REG-7805-SIL3; CIIVA_IDS: 1494330; COMPONENT_LINK_1_DESCRIPTION: Manufacturer URL; COMPONENT_LINK_1_URL: http://www.st.com; DATASHEET: http://www.st.com/internet/com/TECHNICAL_RESOURCES/TECHNICAL_LITERATURE/DATASHEET/CD00001635.pdf; DATASHEET_VERSION: 14/07/2008; FOOTPRINT_VARIANT_NAME_0: Level C; FOOTPRINT_VARIANT_NAME_1: Level B; FOOTPRINT_VARIANT_NAME_2: Level A; IMPORTED: yes; IMPORTED_FROM: vault; IMPORT_TS: 1521842653; MF: STMicroelectronics; MPN: LD2981CU33TR; PACKAGE: SOT-89; PACKAGE_DESCRIPTION: 3-Pin SOT-89 Package 1.5 mm Pitch, 4.1 mm Lead Span; PACKAGE_VERSION: 2011; PREFIX: U; RELEASE_DATE: 1329864115; VAULT_GUID: D31A5547-DC71-496C-B469-D3C4896B0EF1; VAULT_REVISION: 2FAEF0D7-B25B-4AA3-8C5F-6F8AF18FFD96
IC10 IC11 = ic_dac:TEXAS_INSTRUMENTS_DAC8164IBPWG4: TI-DACXX64PW16; CIIVA_IDS: 1106843; CODE__JEDEC: MO-153; COMPONENT_LINK_1_DESCRIPTION: Manufacturer URL; COMPONENT_LINK_1_URL: http://www.ti.com/; COMPONENT_LINK_3_DESCRIPTION: Package Specification; COMPONENT_LINK_3_URL: http://www.ti.com/lit/ml/mpds361/mpds361.pdf; DAC_CHANNELS: 4; DATASHEET: http://www.ti.com/general/docs/lit/getliterature.tsp?genericPartNumber=DAC8164&fileType=pdf; DATASHEET_VERSION: SBAS410B; DNL_MAX__LSB: 1; FOOTPRINT_VARIANT_NAME_0: Level C; FOOTPRINT_VARIANT_NAME_1: Level B; FOOTPRINT_VARIANT_NAME_2: Level A; IMPORTED: yes; IMPORTED_FROM: vault; IMPORT_TS: 1521847417; INL_MAX__LSB: 2; INTERFACE: Serial SPI; MF: Texas Instruments; MOUNTING_TECHNOLOGY: Surface Mount; MPN: DAC8164IBPWG4; PACKAGE: PW16; PACKAGE_DESCRIPTION: 16-Pin Plastic Small Outline, Body 5 x 4.4 mm, Pitch 0.65 mm; PACKAGE_VERSION: 4040064-4/G, 02/2011; PIN_0_0_9_INSIDE_EDGE: clock; POWER_CONSUMPTIONTYPMW: 2.6; PREFIX: U; RELEASE_DATE: 1386925912; RESOLUTION_BITS: 14; ROHS: Yes; SETTLING_TIMEUS: 8; SFDRD_B: 79; SNRD_B: 87; SUB_FAMILY: Precision DAC (=<10MSPS); VAULT_GUID: 4CBE38FC-6508-4746-89A4-DCA776D537C7; VAULT_REVISION: 57F45E06-978A-418D-B5AB-51E808FEEA60
IC12 = ic_analogue:CD4051: IC MUX/DEMUX 8X1 16TSSOP
L1 L2 = resistors:INDUCTOR
Q1-Q16 = transistors:BS170: N-CHANNEL MOS FET
R1-R94 R99-R116 = resistors:RESISTOR: RESISTOR, European symbol